# EAGLE design jalpic_one (EAGLE 9.3.1)
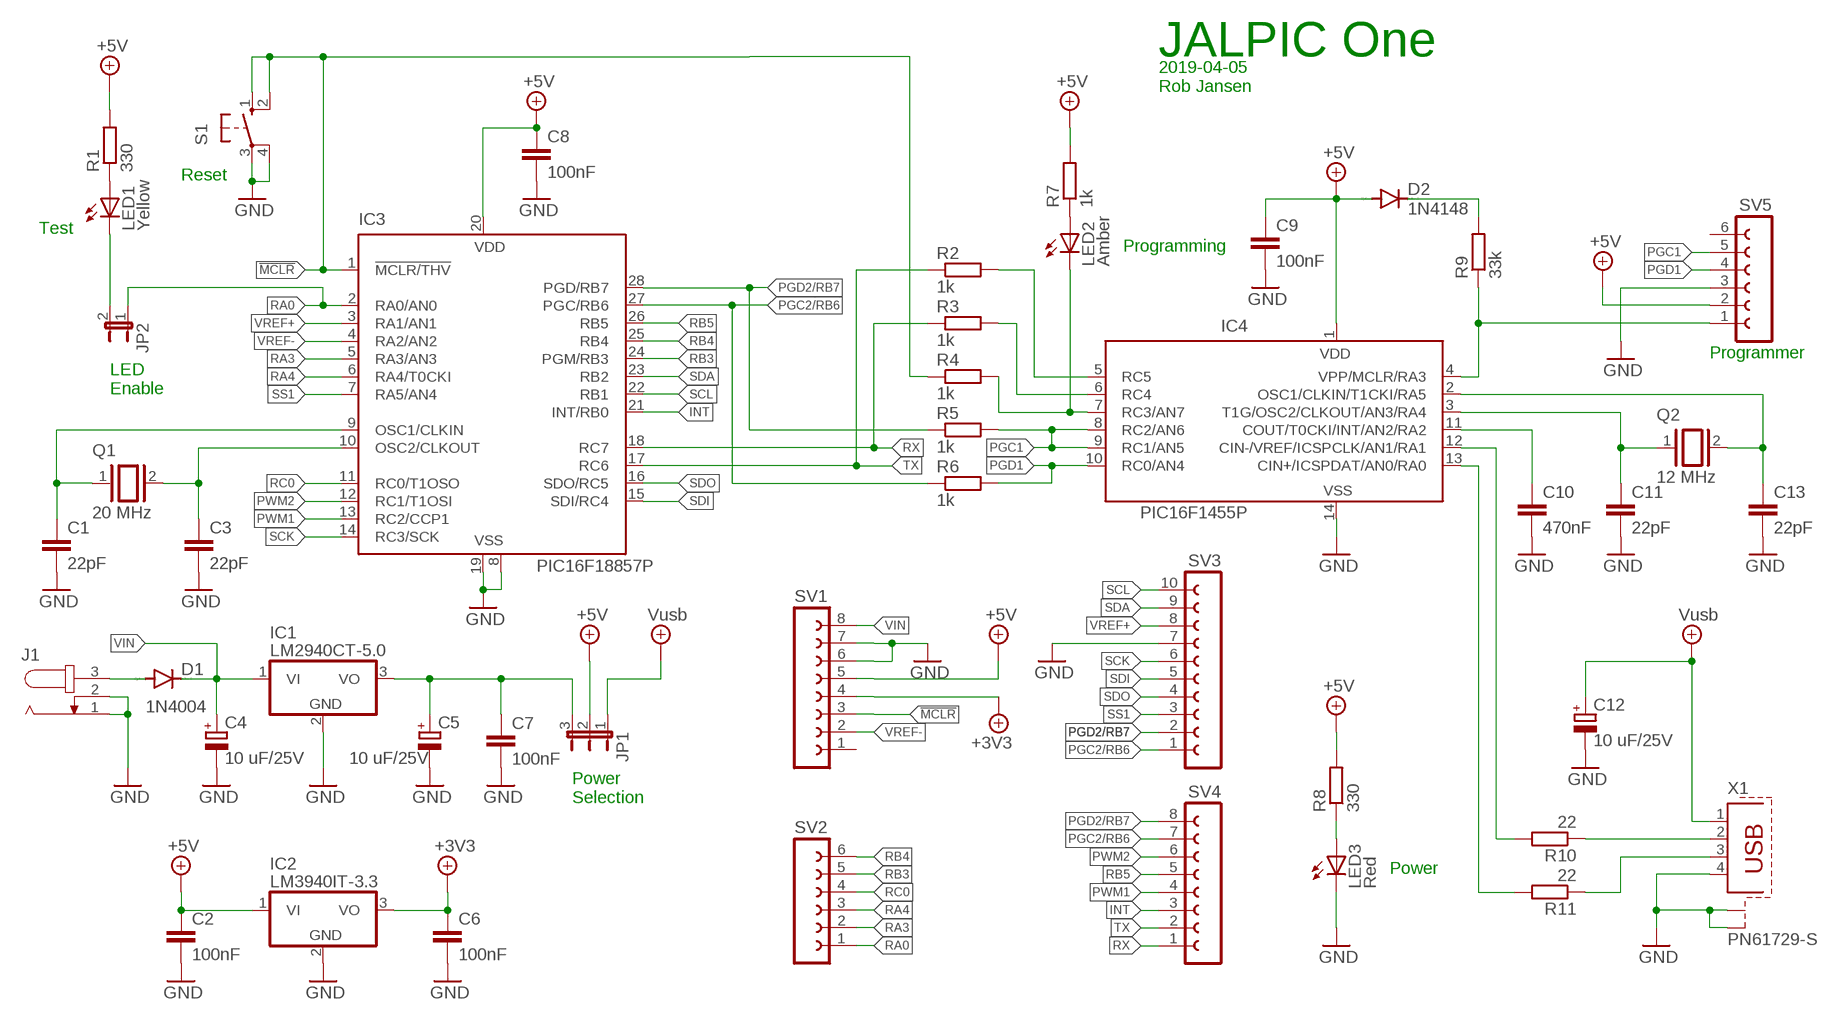
[diagram p0: schematic, sheet 1]

## Parts
C1  22pF  C-EU050-024X044  [C050-024X044]
C2  100nF  C-EU050-024X044  [C050-024X044]
C3  22pF  C-EU050-024X044  [C050-024X044]
C4  10 uF/25V  CPOL-EUE2-5  [E2-5]
C5  10 uF/25V  CPOL-EUE2-5  [E2-5]
C6  100nF  C-EU050-024X044  [C050-024X044]
C7  100nF  C-EU050-024X044  [C050-024X044]
C8  100nF  C-EU050-024X044  [C050-024X044]
C9  100nF  C-EU050-024X044  [C050-024X044]
C10  470nF  C-EU050-024X044  [C050-024X044]
C11  22pF  C-EU050-024X044  [C050-024X044]
C12  10 uF/25V  CPOL-EUE2-5  [E2-5]
C13  22pF  C-EU050-024X044  [C050-024X044]
D1  1N4004  1N4148DO35-7  [DO35-7]
D2  1N4148  1N4148DO35-7  [DO35-7]
IC1  LM2940CT-5.0  7805TV  [TO220V]
IC2  LM3940IT-3.3  7805TV  [TO220V]
IC3  PIC16F18857P  PIC16LF872P  [DIL28-3]
IC4  PIC16F1455P  PIC16F676P  [DIL14]
J1  JACK-PLUG0  [SPC4077]
JP1  JP2E  [JP2]
JP2  JP1E  [JP1]
LED1  Yellow  LED5MM  [LED5MM]
LED2  Amber  LED5MM  [LED5MM]
LED3  Red  LED5MM  [LED5MM]
Q1  20 MHz  XTAL/S  [QS]
Q2  12 MHz  XTAL/S  [QS]
R1  330  R-EU_0207/7  [0207/7]
R2  1k  R-EU_0207/7  [0207/7]
R3  1k  R-EU_0207/7  [0207/7]
R4  1k  R-EU_0207/7  [0207/7]
R5  1k  R-EU_0207/7  [0207/7]
R6  1k  R-EU_0207/7  [0207/7]
R7  1k  R-EU_0207/7  [0207/7]
R8  330  R-EU_0207/7  [0207/7]
R9  33k  R-EU_0207/7  [0207/7]
R10  22  R-EU_0207/7  [0207/7]
R11  22  R-EU_0207/7  [0207/7]
S1  10-XX  [B3F-10XX]
SV1  FE08-1  [FE08]
SV2  FE06-1  [FE06]
SV3  FE10-1  [FE10]
SV4  FE08-1  [FE08]
SV5  FE06-1  [FE06]
X1  PN61729-S  [PN61729-S]

## Nets
!MCLR: IC3.1(!MCLR/THV) R4.1 S1.1(S) S1.2(S1) SV1.3
+4.1V: C6.1 IC2.3(VO) SV1.4 ; supply symbol labelled +3V3
+5V: C2.1 C8.1 C9.1 D2.A IC2.1(VI) IC3.20(VDD) IC4.1(VDD) JP1.2 R1.2 R7.2 R8.2 SV1.5 SV5.2
+9V: C12.+ JP1.1 X1.1 ; supply symbol labelled Vusb
GND: C1.2 C2.2 C3.2 C4.- C5.- C6.2 C7.2 C8.2 C9.2 C10.2 C11.2 C12.- C13.2 IC1.2(GND) IC2.2(GND) IC3.8(VSS) IC3.19(VSS) IC4.14(VSS) J1.1 J1.2 LED3.K(C) S1.3(P) S1.4(P1) SV1.6 SV1.7 SV3.7 SV5.3 X1.4 X1.S1 X1.S2
INT: IC3.21(INT/RB0) SV4.3
N$1: D1.A J1.3
N$2: IC4.4(VPP/MCLR/RA3) R9.1 SV5.1
N$3: JP2.2 LED1.K(C)
N$4: C5.+ C7.1 IC1.3(VO) JP1.3
N$5: C10.1 IC4.11(COUT/T0CKI/INT/AN2/RA2)
N$6: LED1.A R1.1
N$7: LED3.A R8.1
N$8: IC4.7(RC3/AN7) LED2.K(C) R4.2
N$9: IC4.12(CIN-/VREF/ICSPCLK/AN1/RA1) R10.2
N$10: C11.1 IC4.3(T1G/OSC2/CLKOUT/AN3/RA4) Q2.1
N$11: C13.1 IC4.2(OSC1/CLKIN/T1CKI/RA5) Q2.2
N$12: C3.1 IC3.10(OSC2/CLKOUT) Q1.2
N$13: IC4.6(RC4) R3.2
N$14: IC4.5(RC5) R2.2
N$15: IC4.13(CIN+/ICSPDAT/AN0/RA0) R11.2
N$16: C1.1 IC3.9(OSC1/CLKIN) Q1.1
N$17: LED2.A R7.1
N$19: R10.1 X1.2
N$20: R11.1 X1.3
N$22: D2.C R9.2
PGC1: IC4.8(RC2/AN6) IC4.9(RC1/AN5) R5.2 SV5.5
PGC2/RB6: IC3.27(PGC/RB6) R6.1 SV3.1 SV4.7
PGD1: IC4.10(RC0/AN4) R6.2 SV5.4
PGD2/RB7: IC3.28(PGD/RB7) R5.1 SV3.2 SV4.8
PWM1: IC3.13(RC2/CCP1) SV4.4
PWM2: IC3.12(RC1/T1OSI) SV4.6
RA0: IC3.2(RA0/AN0) JP2.1 SV2.1
RA3: IC3.5(RA3/AN3) SV2.2
RA4: IC3.6(RA4/T0CKI) SV2.3
RB3: IC3.24(PGM/RB3) SV2.5
RB4: IC3.25(RB4) SV2.6
RB5: IC3.26(RB5) SV4.5
RC0: IC3.11(RC0/T1OSO) SV2.4
RX: IC3.18(RC7) R3.1 SV4.1
SCK: IC3.14(RC3/SCK) SV3.6
SCL: IC3.22(RB1) SV3.10
SDA: IC3.23(RB2) SV3.9
SDI: IC3.15(SDI/RC4) SV3.5
SDO: IC3.16(SDO/RC5) SV3.4
SS1: IC3.7(RA5/AN4) SV3.3
TX: IC3.17(RC6) R2.1 SV4.2
VIN: C4.+ D1.C IC1.1(VI) SV1.8
VREF+: IC3.3(RA1/AN1) SV3.8
VREF-: IC3.4(RA2/AN2) SV1.2
Unconnected: SV1.1 SV5.6

## Notes on the sheet
- JALPIC One
- 2019-04-05
  Rob Jansen
- Reset
- Test
- Programming
- Programmer
- LED
  Enable
- Power
  Selection
- Power

## Library data of the parts
C1-C3 C6-C11 C13 = rcl:C-EU: CAPACITOR, European symbol; SPICEPREFIX: C
C4 C5 C12 = rcl:CPOL-EU: POLARIZED CAPACITOR, European symbol; SPICEPREFIX: C
D1 D2 = diode:1N4148: DIODE high speed (Philips)
IC1 IC2 = linear:78*: Positive VOLTAGE REGULATOR Source: http://cache.national.com/ds/LM/LM78L05.pdf http://www.fairchildsemi.com/ds/LM/LM7805.pdf
IC3 = microchip:PIC16*872: MICROCONTROLLER flash type; MPN: PIC16LF872-I/SP; OC_FARNELL: 9761730; OC_NEWARK: 97K7491
IC4 = microchip:PIC16F676: 14-Pin, Flash-Based 8-Bit CMOS Microcontroller High Performance RISC CPU: * Only 35 instructions to learn - All single-cycle instructions except branches * Operating speed: - DC - 20 MHz oscillator/clock input - DC - 200 ns instruction cycle * Internal and external oscillator options - Precision Internal 4 MHz oscillator factory calibrated to ±1% - External Oscillator support for crystals and resonators - 5?s wake-up from SLEEP, 3.0V, typical * Power saving SLEEP mode * Wide operating voltage range - 2.0V to 5.5V * Industrial and Extended temperature range * Low power Power-on Reset (POR) * Power-up Timer (PWRT) and Oscillator Start-up Timer (OST) * Brown-out Detect (BOD) * Watchdog Timer (WDT) with independent oscillator for reliable operation * Multiplexed MCLR/Input-pin * Interrupt-on-pin change * Individual programmable weak pull-ups * Programmable code protection * High Endurance FLASH/EEPROM Cell - 100,000 write FLASH endurance - 1,000,000 write EEPROM endurance - FLASH/Data EEPROM Retention: > 40 years * Standby Current: - 1 nA @ 2.0V, typical * Operating Current: - 8.5?A @ 32 kHz, 2.0V, typical - 100?A @ 1 MHz, 2.0V, typical * Watchdog Timer Current - 300 nA @ 2.0V, typical * Timer1 oscillator current: - 4?A @ 32 kHz, 2.0V, typical * 12 I/O pins with individual direction control * High current sink/source for direct LED drive * Analog-to-Digital Converter module (PIC16F676): - 10-bit resolution - Programmable 8-channel input - Voltage reference input * In-Circuit Serial ProgrammingTM (ICSPTM) via two pins Source: http://ww1.microchip.com/downloads/en/DeviceDoc/40039E.pdf; MF: MICROCHIP; MPN: PIC16F676-I/P; OC_FARNELL: 9760512; OC_NEWARK: 54K2829
J1 = con-jack:JACK-PLUG: DC POWER JACK Power Jack, DC, Right Angle, Through Hole, Rated 5A at 16VDC, PC Terminals Distributor: Farnell (www.Farnell.de) Drawing: 84N1161.pdf / 84N1162.pdf Manufacturer: SPC Technology (www.spctechnology.com) Type: SPC4077 / SPC 4078; OC_FARNELL: unknown; OC_NEWARK: unknown
JP1 = jumper:JP2E: JUMPER
JP2 = jumper:JP1E: JUMPER
LED1-LED3 = led:LED: LED OSRAM: - CHIPLED LG R971, LG N971, LY N971, LG Q971, LY Q971, LO R971, LY R971 LH N974, LH R974 LS Q976, LO Q976, LY Q976 LO Q996 - Hyper CHIPLED LW Q18S LB Q993, LB Q99A, LB R99A - SideLED LS A670, LO A670, LY A670, LG A670, LP A670 LB A673, LV A673, LT A673, LW A673 LH A674 LY A675 LS A676, LA A676, LO A676, LY A676, LW A676 LS A679, LY A679, LG A679 - Hyper Micro SIDELED® LS Y876, LA Y876, LO Y876, LY Y876 LT Y87S - SmartLED LW L88C, LW L88S LB L89C, LB L89S, LG L890 LS L89K, LO L89K, LY L89K LS L896, LA L896, LO L896, LY L896 - TOPLED LS T670, LO T670, LY T670, LG T670, LP T670 LSG T670, LSP T670, LSY T670, LOP T670, LYG T670 LG T671, LOG T671, LSG T671 LB T673, LV T673, LT T673, LW T673 LH T674 LS T676, LA T676, LO T676, LY T676, LB T676, LH T676, LSB T676, LW T676 LB T67C, LV T67C, LT T67C, LS T67K, LO T67K, LY T67K, LW E67C LS E67B, LA E67B, LO E67B, LY E67B, LB E67C, LV E67C, LT E67C LW T67C LS T679, LY T679, LG T679 LS T770, LO T770, LY T770, LG T770, LP T770 LB T773, LV T773, LT T773, LW T773 LH T774 LS E675, LA E675, LY E675, LS T675 LS T776, LA T776, LO T776, LY T776, LB T776 LHGB T686 LT T68C, LB T68C - Hyper Mini TOPLED® LB M676 - Mini TOPLED Santana® LG M470 LS M47K, LO M47K, LY M47K Source: http://www.osram.convergy.de LUXEON: - LUMILED® LXK2-PW12-R00, LXK2-PW12-S00, LXK2-PW14-U00, LXK2-PW14-V00 LXK2-PM12-R00, LXK2-PM12-S00, LXK2-PM14-U00 LXK2-PE12-Q00, LXK2-PE12-R00, LXK2-PE12-S00, LXK2-PE14-T00, LXK2-PE14-U00 LXK2-PB12-K00, LXK2-PB12-L00, LXK2-PB12-M00, LXK2-PB14-N00, LXK2-PB14-P00, LXK2-PB14-Q00 LXK2-PR12-L00, LXK2-PR12-M00, LXK2-PR14-Q00, LXK2-PR14-R00 LXK2-PD12-Q00, LXK2-PD12-R00, LXK2-PD12-S00 LXK2-PH12-R00, LXK2-PH12-S00 LXK2-PL12-P00, LXK2-PL12-Q00, LXK2-PL12-R00 Source: www.luxeon.com KINGBRIGHT: KA-3528ASYC Source: www.kingbright.com
Q1 Q2 = special:XTAL/S: CRYSTAL
R1-R11 = rcl:R-EU_: RESISTOR, European symbol; SPICEPREFIX: R
S1 = switch-omron:10-XX: OMRON SWITCH; MPN: B3F-1000; OC_FARNELL: 176432; OC_NEWARK: 36M3542
SV1 SV4 = con-lsta:FE08-1: FEMALE HEADER; OC_FARNELL: unknown; OC_NEWARK: unknown
SV2 SV5 = con-lsta:FE06-1: FEMALE HEADER; OC_FARNELL: unknown; OC_NEWARK: unknown
SV3 = con-lsta:FE10-1: FEMALE HEADER; OC_FARNELL: unknown; OC_NEWARK: unknown
X1 = con-berg:PN61729-S: BERG USB connector; OC_FARNELL: unknown; OC_NEWARK: unknown

## Board
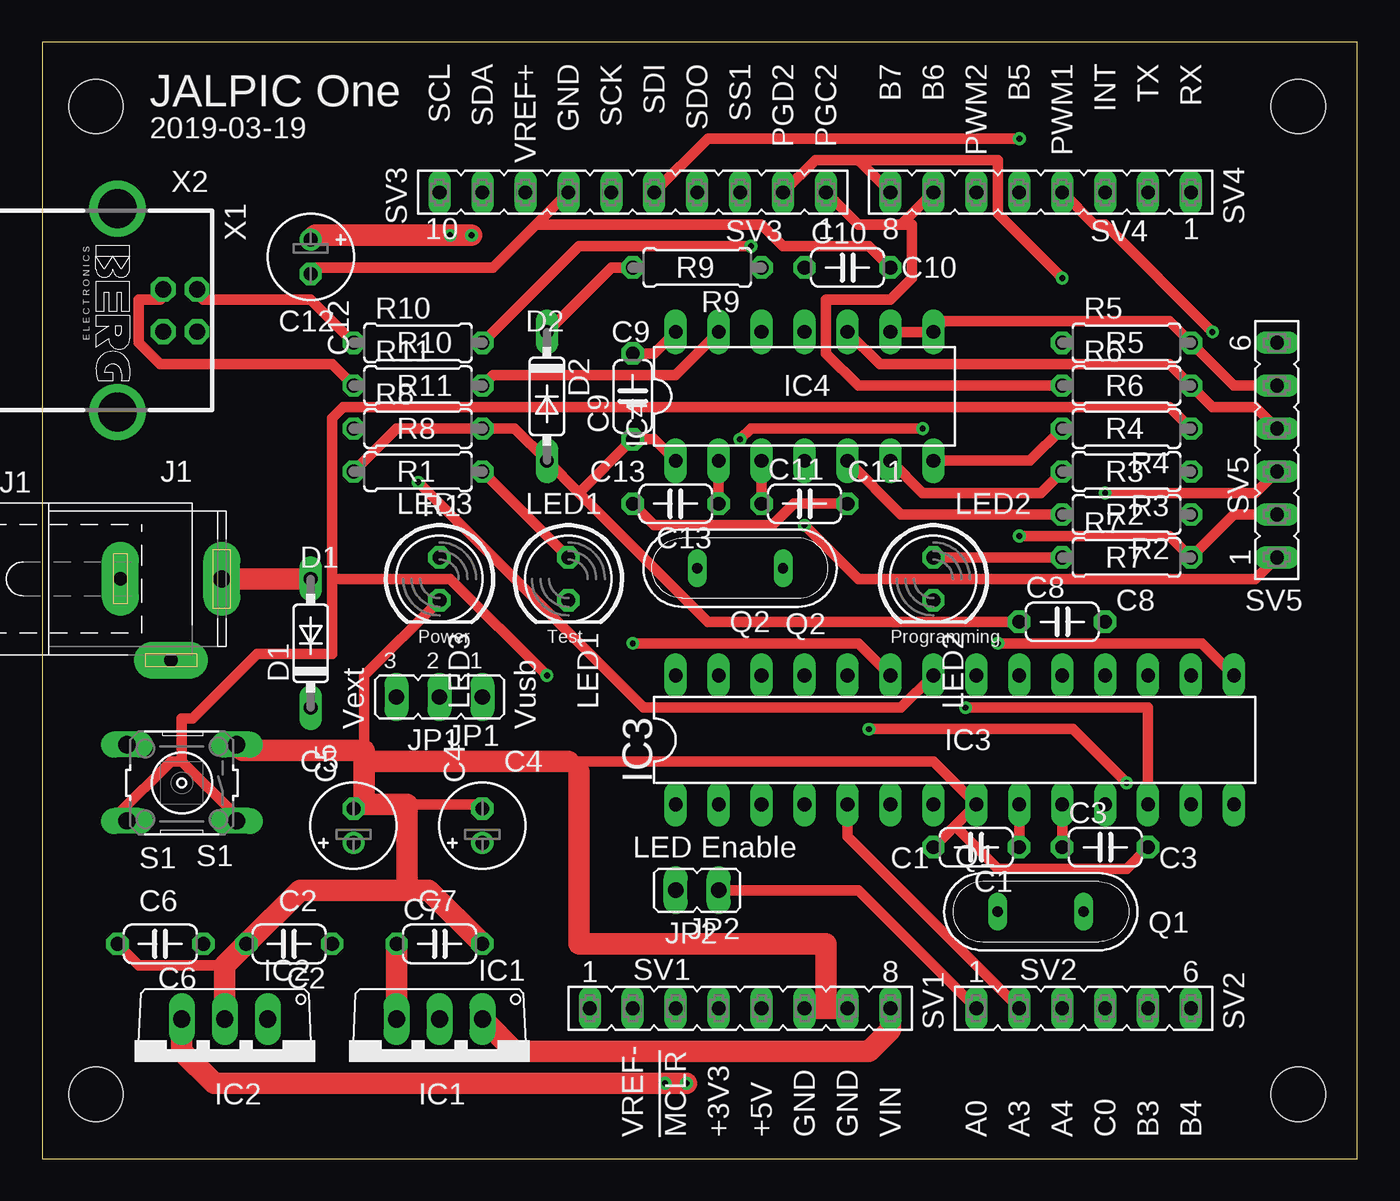
[diagram p1: board, top side]
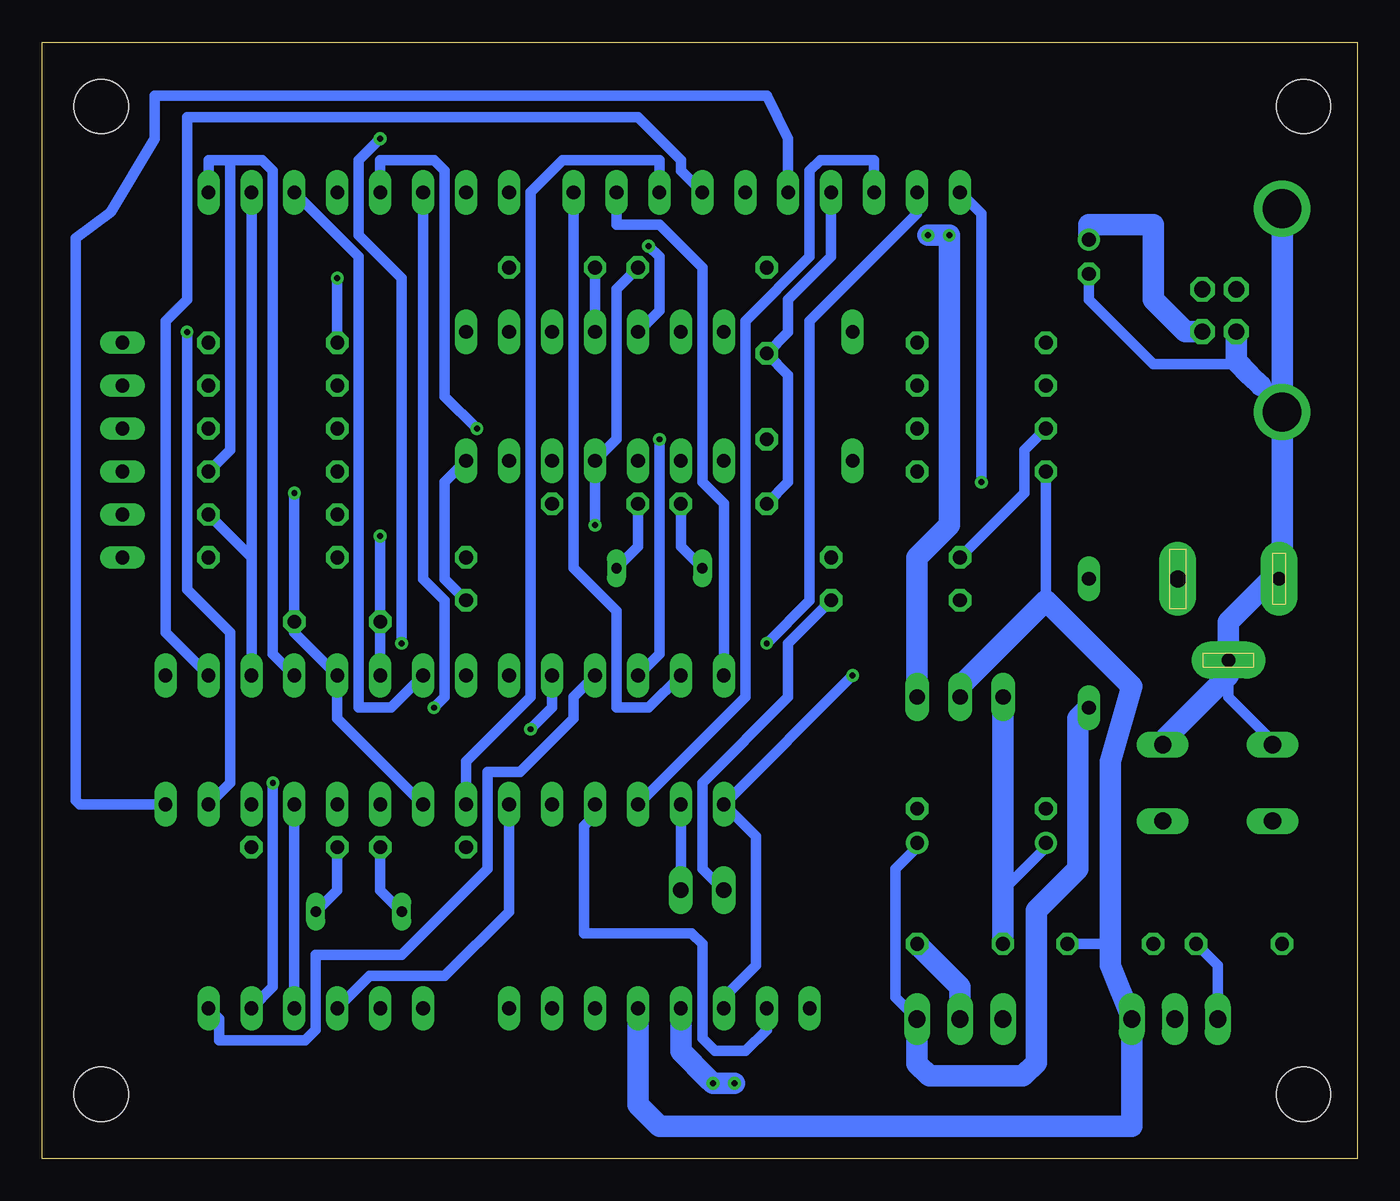
[diagram p2: board, bottom side, seen from below]

Size 77.78 x 66.03 mm. Coordinates in mm from the lower left corner, seen from the top.
Outline: 0,0 77.78,0 77.78,66.03 0,66.03 0,0
Copper layers (1*16): Top 0.035mm / dielectric 1.5mm / Bottom 0.035mm
Design rules "jalpic_one_1 *": minimum track width 25mil, minimum drill 0.35mm, track to track 10mil, track to pad 10mil, pad to pad 10mil, via to via 10mil, smd to smd 6mil, copper to edge 40mil, drill to drill 10mil, minimum pad ring 10mil, minimum via ring 8mil, stop-mask expansion 4mil, vias tented up to drill 0mil, thermal gap 10mil
Holes 3.2 mm at 3.18,3.81 3.18,62.23 74.29,3.81 74.29,62.23

### Footprints (pad centres in the part's own frame; a part is rotated, then mirrored left to right if it is on the bottom)
C050-024X044 = drill 0.813 octagon: 1 -2.54,0; 2 2.54,0
E2-5 = drill 0.813 pad 1.27: + -1.016,0 | drill 0.813 pad 1.27 octagon: - 1.016,0
DO35-7 = drill 0.813 long: A 3.81,0; C -3.81,0
TO220V = drill 1.016 long: 1 -2.54,-2.54; 2 0,-2.54; 3 2.54,-2.54
DIL28-3 = drill 0.813 long: 1 -16.51,-3.81; 2 -13.97,-3.81; 3 -11.43,-3.81; 4 -8.89,-3.81; 5 -6.35,-3.81; 6 -3.81,-3.81; 7 -1.27,-3.81; 8 1.27,-3.81; 9 3.81,-3.81; 10 6.35,-3.81; 11 8.89,-3.81; 12 11.43,-3.81; 13 13.97,-3.81; 14 16.51,-3.81; 15 16.51,3.81; 16 13.97,3.81; 17 11.43,3.81; 18 8.89,3.81; 19 6.35,3.81; 20 3.81,3.81; 21 1.27,3.81; 22 -1.27,3.81; 23 -3.81,3.81; 24 -6.35,3.81; 25 -8.89,3.81; 26 -11.43,3.81; 27 -13.97,3.81; 28 -16.51,3.81
DIL14 = drill 0.813 long: 1 -7.62,-3.81; 2 -5.08,-3.81; 3 -2.54,-3.81; 4 0,-3.81; 5 2.54,-3.81; 6 5.08,-3.81; 7 7.62,-3.81; 8 7.62,3.81; 9 5.08,3.81; 10 2.54,3.81; 11 0,3.81; 12 -2.54,3.81; 13 -5.08,3.81; 14 -7.62,3.81
SPC4077 = drill 0.8 pad 2.184 long: 1 -3,0; 2 0,-4.8 | drill 1 pad 2.184 long: 3 3,0
JP2 = drill 0.914 long: 1 -2.54,0; 2 0,0; 3 2.54,0
JP1 = drill 0.914 long: 1 0,-1.27; 2 0,1.27
LED5MM = drill 0.813 octagon: A -1.27,0; K 1.27,0
QS = drill 0.61 long: 1 -2.54,0; 2 2.54,0
0207/7 = drill 0.813 octagon: 1 -3.81,0; 2 3.81,0
B3F-10XX = drill 1.016 long: 1 -3.251,2.261; 2 3.251,2.261; 3 -3.251,-2.261; 4 3.251,-2.261
FE08 = drill 0.813 long: 1 -8.89,0; 2 -6.35,0; 3 -3.81,0; 4 -1.27,0; 5 1.27,0; 6 3.81,0; 7 6.35,0; 8 8.89,0
FE06 = drill 0.813 long: 1 -6.35,0; 2 -3.81,0; 3 -1.27,0; 4 1.27,0; 5 3.81,0; 6 6.35,0
FE10 = drill 0.813 long: 1 -11.43,0; 2 -8.89,0; 3 -6.35,0; 4 -3.81,0; 5 -1.27,0; 6 1.27,0; 7 3.81,0; 8 6.35,0; 9 8.89,0; 10 11.43,0
PN61729-S = drill 0.95 octagon: 1 1.25,4.71; 2 -1.25,4.71; 3 -1.25,2.71; 4 1.25,2.71 | drill 2.3 pad 2.9: S1 -6.02,0; S2 6.02,0

### Placement (x,y rotation side)
C1  55.24,18.41 180 top
C2  14.61,12.7 180 top
C3  62.87,18.41 0 top
C4  26.04,19.69 90 top
C5  18.41,19.69 90 top
C6  6.99,12.7 180 top
C7  23.5,12.7 0 top
C8  60.33,31.75 0 top
C9  34.92,45.09 90 top
C10  47.62,52.7 0 top
C11  45.09,38.73 0 top
C12  15.88,53.34 270 top
C13  37.47,38.73 180 top
D1  15.88,30.48 90 top
D2  29.84,45.09 270 top
IC1  23.5,5.71 180 top
IC2  10.79,5.71 180 top
IC3  53.98,24.77 0 top
IC4  45.09,45.09 0 top
J1  7.62,34.29 0 top
JP1  23.5,27.3 180 top
JP2  38.73,15.88 90 top
LED1  31.12,34.29 270 top
LED2  52.7,34.29 270 top
LED3  23.5,34.29 270 top
Q1  59.05,14.61 0 top
Q2  41.27,34.92 180 top
R1  22.23,40.64 180 top
R2  64.13,38.1 180 top
R3  64.13,40.64 180 top
R4  64.13,43.18 180 top
R5  64.13,48.26 0 top
R6  64.13,45.72 0 top
R7  64.13,35.56 0 top
R8  22.23,43.18 0 top
R9  38.73,52.7 180 top
R10  22.23,48.26 0 top
R11  22.23,45.72 0 top
S1  8.26,22.23 180 top
SV1  41.27,8.89 0 top
SV2  61.59,8.89 0 top
SV3  34.92,57.15 180 top
SV4  59.05,57.15 180 top
SV5  73.03,41.91 90 top
X1  4.45,50.16 270 top

### Tracks (layer width: path | path; a pad name or v marks a point on that pad's centre or on a via)
!MCLR  (via drill 0.35)
  Top 0.635: R4.1 66.67,44.45 17.78,44.45 17.14,43.82 17.14,34.29 | 17.14,34.29 17.14,29.84 12.7,29.84 8.89,26.03 8.26,26.03 8.26,23.49 | S1.2 4.45,20.32 7.62,23.49 8.26,23.49 | 8.26,23.49 11.43,20.32 S1.1 | v29.84,28.58 24.13,34.29 17.14,34.29
  Bottom 0.635: SV1.3 37.47,9.52 35.56,11.43 35.56,19.05 IC3.1 v29.84,28.58
+4.1V  (via drill 0.35)
  Top 1.27: 37.47,4.44 v36.83,4.44 | v38.1,4.44 37.47,4.44 | 37.47,4.44 10.16,4.44 8.26,6.35 IC2.3
  Bottom 0.635: C6.1 8.26,11.43 IC2.3
  Bottom 1.27: v36.83,4.44 v38.1,4.44 38.42,4.76 40.01,6.35 SV1.4
+5V  (via drill 0.35)
  Top 0.635: SV5.2 70.49,38.1 R7.2 66.67,36.83 v57.79,36.83 | IC4.1 36.2,42.55 C9.1 31.75,39.37 | R1.2 20.96,43.18 R8.2 27.94,43.18 D2.A 31.75,39.37 | C8.1 39.37,31.75 31.75,39.37
  Bottom 0.635: IC3.20 C8.1 v57.79,36.83 | R1.2 18.41,33.02 | 14.61,12.7 C2.1
  Bottom 1.27: SV1.5 42.55,3.17 41.27,1.9 13.34,1.9 IC2.1 14.61,11.43 14.61,12.7 14.61,23.49 13.34,27.94 18.41,33.02 23.5,27.94 JP1.2
+9V  (via drill 0.35)
  Top 1.27: C12.+ 16.13,54.61 v24.13,54.61 v25.4,54.61
  Bottom 1.27: X1.1 10.18,48.91 12.07,50.8 12.07,55.25 15.88,55.25 C12.+ | JP1.1 26.04,35.56 24.13,37.46 24.13,50.8 v24.13,54.61 v25.4,54.61
GND  (via drill 0.35)
  Top 0.635: SV5.3 71.75,39.37 v62.87,39.37 | 53.98,19.69 IC3.8 52.7,23.49 31.12,23.49 31.75,22.86 | 53.98,19.69 C1.2 | C3.2 64.13,17.14 59.05,17.14 56.52,17.14 53.98,19.69 | C6.2 5.71,11.43 10.79,11.43 | 21.59,20.95 26.04,20.95 C4.- | LED3.K 19.05,28.58 19.05,24.13 | C11.2 44.45,38.73 43.18,37.46 36.2,37.46 C13.2 | IC4.14 36.2,47.62 C9.2 | 29.21,55.25 26.67,52.7 15.88,52.7 C12.- | 29.21,55.25 SV3.7 | C10.2 48.9,53.98 43.81,53.98 42.55,55.25 29.21,55.25 | 19.05,20.95 18.41,20.95 C5.- 19.05,20.95
  Top 1.27: SV1.7 46.35,8.89 | 46.35,8.89 SV1.6 | IC2.2 10.79,11.43 C2.2 15.24,15.88 21.59,15.88 | 19.05,24.13 19.05,20.95 21.59,20.95 21.59,15.88 | 19.05,24.13 19.05,23.49 31.12,23.49 | C7.2 22.86,15.88 21.59,15.88 | 19.05,24.13 11.86,24.13 S1.3 | 31.75,22.86 31.75,12.7 46.35,12.7 46.35,8.89
  Bottom 0.635: v62.87,39.37 C8.2 62.87,31.12 IC3.19 60.33,26.03 IC3.8 | S1.4 5.08,24.77 7.62,27.3 7.62,28.58 7.62,29.21 J1.2 7.62,29.84 | 11.71,24.49 S1.3 | 5.08,34.29 J1.1 4.45,34.29 | C13.2 33.66,40.01 33.66,46.36 C9.2 33.66,48.9 33.66,50.8 31.12,53.34 SV3.7 | C12.- 15.88,50.8 12.07,46.99 6.99,46.99 7.16,47.16 | 5.71,45.72 4.45,44.45 X1.S2 4.45,43.82 | 4.45,55.88 X1.S1
  Bottom 1.27: 11.71,24.49 7.62,28.58 J1.2 | 5.08,34.29 7.62,31.75 7.62,29.84 | C7.2 23.5,10.16 IC1.2 | X1.4 7.16,47.16 6.35,46.36 5.71,45.72 | 4.45,44.45 4.45,55.88 | 4.45,43.82 4.45,34.29
INT
  Bottom 0.635: IC3.21 57.15,26.67 59.05,26.67 59.05,53.34 SV4.3
N$1
  Top 0.635: 10.79,34.29 J1.3
  Top 1.27: 10.79,34.29 D1.A
N$2  (via drill 0.35)
  Top 0.635: SV5.1 71.75,34.29 48.26,34.29 v45.09,37.46
  Bottom 0.635: R9.1 43.81,51.44 43.81,42.55 IC4.4 v45.09,37.46
N$3
  Bottom 0.635: LED1.K 33.66,30.48 33.66,27.3 38.73,22.23 38.73,17.14 JP2.2
N$4
  Top 1.27: IC1.3 C7.1
  Bottom 0.635: 20.96,15.88 19.69,17.14 18.41,18.41 C5.+
  Bottom 1.27: C7.1 20.96,15.88 JP1.3
N$5
  Bottom 0.635: C10.1 IC4.11
N$6
  Top 0.635: LED1.A R1.1
N$7
  Bottom 0.635: LED3.A 19.69,39.37 19.69,41.91 R8.1
N$8
  Top 0.635: R4.2 58.42,41.27 IC4.7
  Bottom 0.635: LED2.K 53.98,34.29 53.98,40.01 IC4.7
N$9  (via drill 0.35)
  Top 0.635: R10.2 31.75,53.98 v41.91,53.98
  Bottom 0.635: v41.91,53.98 41.27,53.34 41.27,50.16 IC4.12
N$10
  Top 0.635: C11.1 IC4.3
  Bottom 0.635: Q2.1 42.55,36.2 C11.1
N$11
  Top 0.635: C13.1 IC4.2
  Bottom 0.635: Q2.2 40.01,36.2 C13.1
N$12
  Top 0.635: C3.1 IC3.10
  Bottom 0.635: Q1.2 60.33,15.88 C3.1
N$13
  Top 0.635: IC4.6 52.07,39.37 59.05,39.37 R3.2
N$14
  Top 0.635: IC4.5 50.8,38.1 R2.2
N$15
  Top 0.635: R11.2 26.67,46.36 37.47,46.36 IC4.13
N$16
  Top 0.635: C1.1 IC3.9
  Bottom 0.635: Q1.1 57.79,15.88 C1.1
N$17
  Top 0.635: R7.1 LED2.A
N$19
  Top 0.635: R10.1 15.88,50.8 9.53,50.8 X1.2
N$20
  Top 0.635: R11.1 17.14,46.99 6.99,46.99 5.71,48.26 5.71,50.8 6.99,50.8 X1.3
N$22
  Top 0.635: D2.C 33.66,52.7 R9.2
PGC1
  Top 0.635: IC4.9 IC4.8 53.34,49.53 66.67,49.53 R5.2 70.49,45.72 SV5.5
PGC2/RB6
  Top 0.635: 50.8,55.25 SV4.7 | 50.8,55.25 48.26,55.25 SV3.1 | R6.1 48.26,45.72 46.35,47.62 46.35,50.8 50.16,50.8 51.44,52.07 51.44,55.25 50.8,55.25
  Bottom 0.635: IC3.27 41.91,26.67 43.81,26.67 43.81,32.38 46.35,34.92 SV3.1
PGD1
  Top 0.635: IC4.10 49.53,46.99 66.67,46.99 R6.2 69.22,44.45 71.75,44.45 SV5.4
PGD2/RB7  (via drill 0.35)
  Top 0.635: 48.26,59.05 SV4.8 | 48.26,59.05 45.72,59.05 SV3.2 | v60.33,52.07 56.52,55.88 56.52,59.05 48.26,59.05
  Bottom 0.635: IC3.28 37.47,38.73 38.73,40.01 38.73,52.7 41.27,55.25 43.81,55.25 SV3.2 | v60.33,52.07 R5.1
PWM1  (via drill 0.35)
  Top 0.635: v69.22,48.9 62.87,55.25 62.23,55.25 SV4.4
  Bottom 0.635: IC3.13 66.67,22.23 66.67,31.12 69.22,33.66 v69.22,48.9
PWM2  (via drill 0.35)
  Top 0.635: IC3.12 65.41,26.67 v54.61,26.67
  Bottom 0.635: v54.61,26.67 53.98,27.3 53.98,33.02 55.24,34.29 SV4.6
RA0
  Top 0.635: SV2.1 48.26,15.88 JP2.1
  Bottom 0.635: JP2.1 IC3.2
RA3
  Top 0.635: SV2.2 47.62,19.05 IC3.5
RA4
  Bottom 0.635: SV2.3 58.42,10.79 53.98,10.79 50.16,14.61 IC3.6
RB3  (via drill 0.35)
  Top 0.635: v64.13,22.23 60.96,25.4 v48.9,25.4
  Bottom 0.635: SV2.5 64.13,10.16 v64.13,22.23 | v48.9,25.4 47.62,26.67 IC3.24
RB4
  Bottom 0.635: IC3.25 46.35,27.3 46.35,26.03 49.53,22.86 51.44,22.86 51.44,17.14 56.52,12.06 61.59,12.06 61.59,7.62 62.23,6.98 67.31,6.98 67.31,8.25 SV2.6
RB5  (via drill 0.35)
  Top 0.635: v41.27,42.55 41.91,43.18 v52.07,43.18
  Bottom 0.635: IC3.26 41.27,29.84 v41.27,42.55 | v52.07,43.18 53.98,45.09 53.98,58.42 54.61,59.05 57.79,59.05 SV4.5
RC0
  Bottom 0.635: IC3.11 SV2.4
RX
  Bottom 0.635: IC3.18 64.13,29.84 64.13,58.42 64.77,59.05 66.67,59.05 | 66.67,59.05 67.94,59.05 SV4.1 | R3.1 66.67,41.91 66.67,59.05
SCK
  Bottom 0.635: SV3.6 33.66,60.33 34.92,62.87 71.12,62.87 71.12,60.33 73.72,56 75.81,54.43 75.81,21.2 75.56,20.95 IC3.14
SCL  (via drill 0.35)
  Top 0.635: v22.23,40.01 35.56,26.67 50.8,26.67 IC3.22
  Bottom 0.635: SV3.10 22.23,55.88 v22.23,40.01
SDA  (via drill 0.35)
  Top 0.635: IC3.23 48.26,30.48 v34.92,30.48
  Bottom 0.635: v34.92,30.48 32.39,33.02 32.39,49.53 26.04,55.88 SV3.9
SDI  (via drill 0.35)
  Top 0.635: SV3.5 39.37,60.33 v57.79,60.33 | v56.52,30.48 68.58,30.48 IC3.15
  Bottom 0.635: v57.79,60.33 59.05,59.05 59.05,54.61 56.52,52.07 v56.52,30.48
SDO
  Bottom 0.635: SV3.4 40.01,58.42 40.01,59.05 42.55,61.59 69.22,61.59 69.22,50.8 70.49,49.53 70.49,31.12 IC3.16
SS1
  Bottom 0.635: IC3.7 52.7,23.49 48.9,27.3 48.9,57.15 46.99,59.05 41.27,59.05 SV3.3
TX
  Bottom 0.635: 65.41,35.56 IC3.17 | R2.1 65.41,35.56 | 65.41,35.56 SV4.2
VIN
  Top 1.27: SV1.8 50.16,7.62 48.9,6.35 27.94,6.35 IC1.1
  Bottom 0.635: IC1.1 27.3,9.52 27.3,15.88 27.3,17.14 26.04,18.41 C4.+
  Bottom 1.27: D1.C 16.51,26.03 16.51,17.14 18.99,14.67 18.99,5.67 19.77,4.89 25.32,4.89 26.04,5.61 IC1.1
VREF+
  Bottom 0.635: IC3.3 36.2,27.3 36.2,49.53 32.39,53.34 32.39,58.42 31.75,59.05 28.57,59.05 SV3.8
VREF-
  Bottom 0.635: SV1.2 34.92,7.62 36.18,6.36 37.98,6.36 38.73,7.12 38.73,12.7 39.37,13.34 45.72,13.34 45.72,19.69 45.09,20.32 IC3.4

### Text on the board
tPlace: SCL | SDA | VREF+ | GND | SCK | SDI | SDO | SS1 | PGD2 | PGC2 | B7 | B6 | PWM2 | B5 | PWM1 | INT | TX | RX | JALPIC One | 2019-03-19 | X2 | SV3 | SV4 | R9 | C10 | C12 | D2 | C9 | R10 | R5 | R11 | IC4 | R6 | R8 | R4 | J1 | R1 | C13 | C11 | R3 | LED3 | LED1 | LED2 | R2 | D1 | R7 | C8 | SV5 | Q2 | Power | Test | Programming | Vext | Vusb | JP1 | IC3 | C5 | C4 | S1 | LED Enable | C1 | C3 | C6 | C2 | C7 | Q1 | JP2 | SV1 | SV2 | IC2 | IC1 | VREF- | !MCLR | +3V3 | +5V | GND | GND | VIN | A0 | A3 | A4 | C0 | B3 | B4